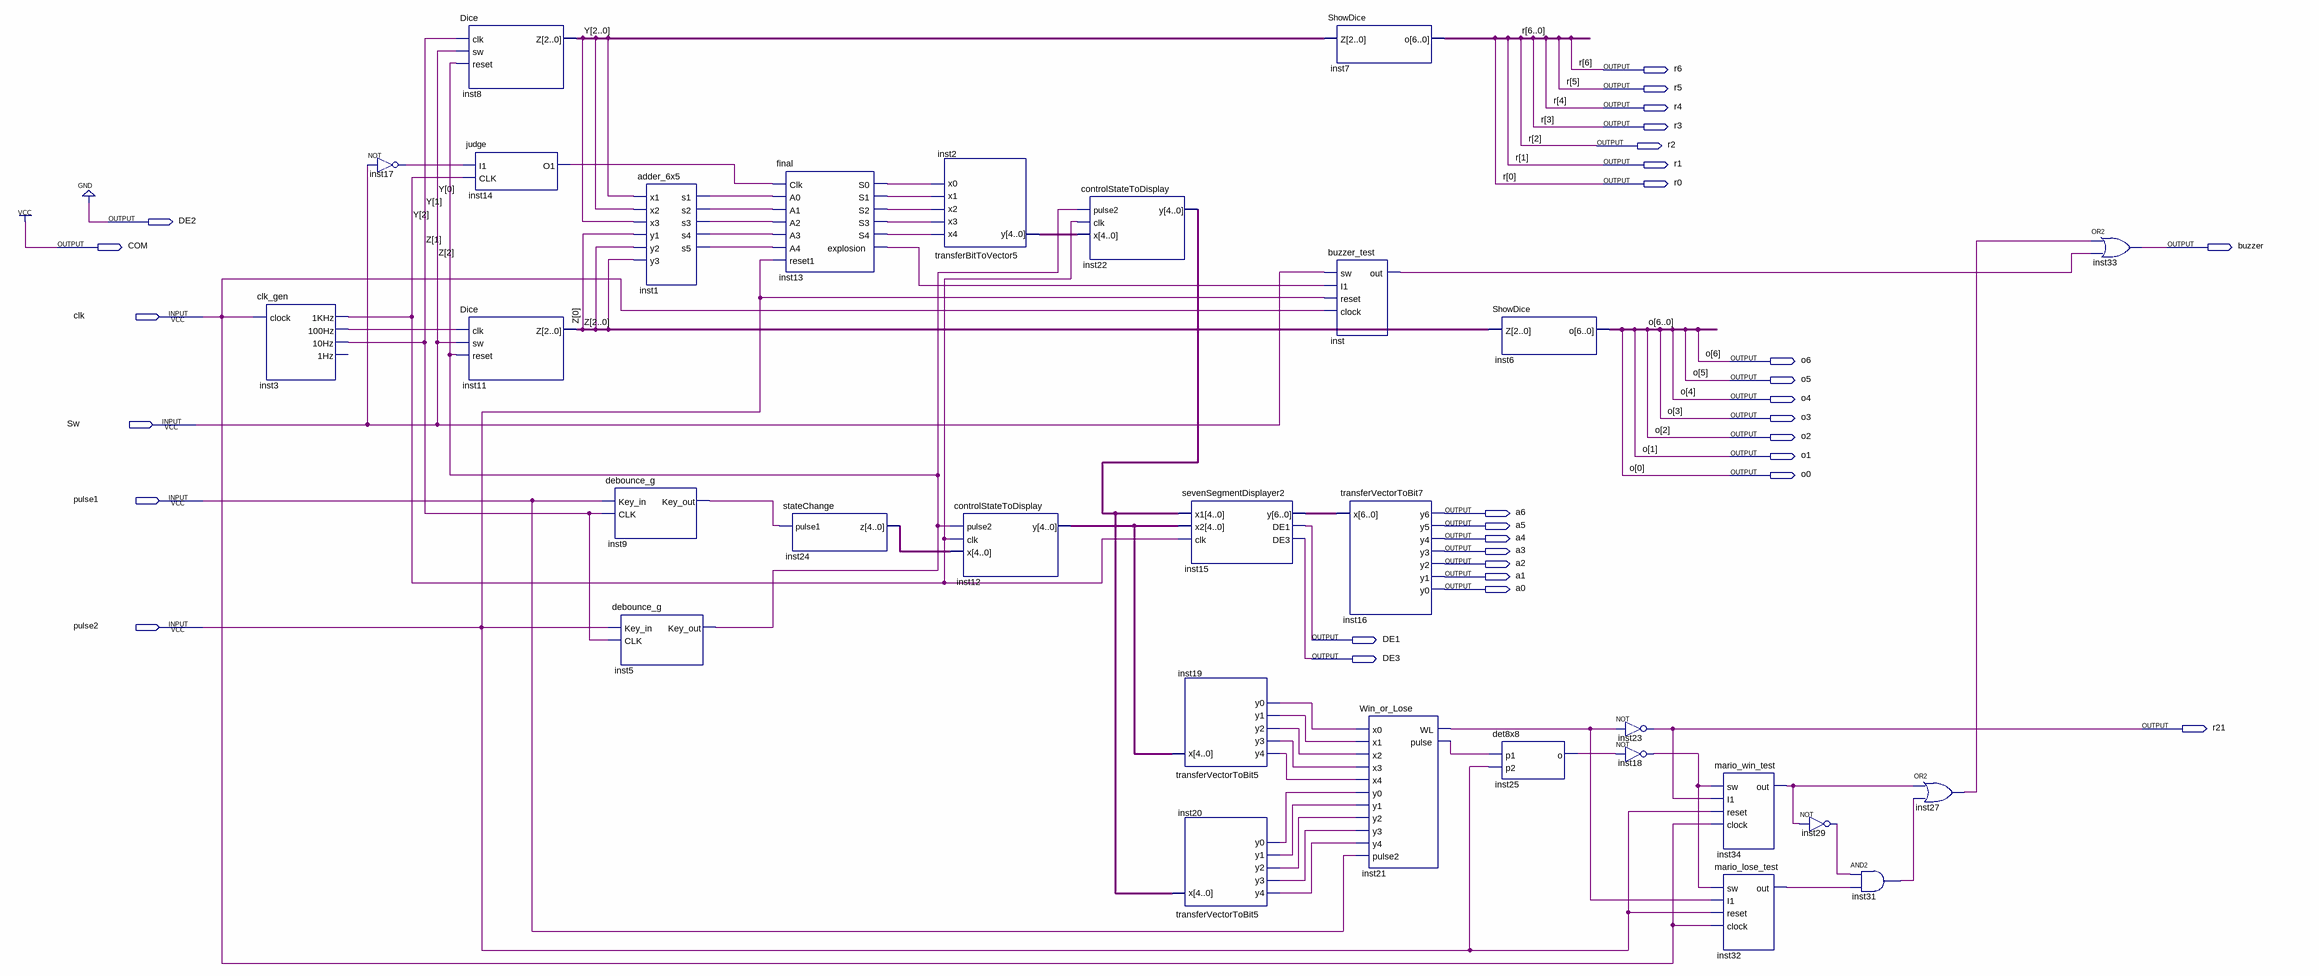
[diagram p0: schematic sheet]
// Quartus schematic DiceTest.bdf as structural Verilog: 30 symbols, 31 pins
module DiceTest (
  input  clk,
  input  Sw,
  input  pulse1,
  input  pulse2,
  output r6,
  output r5,
  output r4,
  output r3,
  output r2,
  output r1,
  output r0,
  output DE2,
  output COM,
  output buzzer,
  output o6,
  output o5,
  output o4,
  output o3,
  output o2,
  output o1,
  output o0,
  output a6,
  output a5,
  output a4,
  output a3,
  output a2,
  output a1,
  output a0,
  output DE1,
  output DE3,
  output r21
);

  wire inst1_s1, inst1_s2, inst1_s3, inst1_s4, inst1_s5, inst3_1khz, inst3_10hz, inst3_100hz, inst5_key_out,
       inst9_key_out, inst13_explosion, inst13_s0, inst13_s1, inst13_s2, inst13_s3, inst13_s4, inst14_o1,
       inst17_out, inst18_out, inst19_y0, inst19_y1, inst19_y2, inst19_y3, inst19_y4, inst20_y0, inst20_y1,
       inst20_y2, inst20_y3, inst20_y4, inst21_pulse, inst21_wl, inst25_o, inst27_out, inst29_out,
       inst31_out, inst32_out, inst34_out, inst_out;
  wire [2:0] Y, Z;
  wire [4:0] inst2_y, inst12_y, inst22_y, inst24_z;
  wire [6:0] inst15_y;

  clk_gen inst3 (.clock(clk), .\1KHz (inst3_1khz), .\100Hz (inst3_100hz), .\10Hz (inst3_10hz));  // open: 1Hz
  not inst17 (inst17_out, Sw);
  Dice inst8 (.clk(inst3_10hz), .sw(Sw), .reset(inst5_key_out), .Z(Y));
  judge inst14 (.I1(inst17_out), .CLK(inst3_1khz), .O1(inst14_o1));
  Dice inst11 (.clk(inst3_100hz), .sw(Sw), .reset(inst5_key_out), .Z(Z));
  debounce_g inst9 (.Key_in(pulse1), .CLK(inst3_10hz), .Key_out(inst9_key_out));
  adder_6x5 inst1 (
    .x1(Y[0]), .x2(Y[1]), .x3(Y[2]), .y1(Z[0]), .y2(Z[1]), .y3(Z[2]), .s1(inst1_s1), .s2(inst1_s2),
    .s3(inst1_s3), .s4(inst1_s4), .s5(inst1_s5));
  debounce_g inst5 (.Key_in(pulse2), .CLK(inst3_10hz), .Key_out(inst5_key_out));
  \final  inst13 (
    .Clk(inst14_o1), .A0(inst1_s1), .A1(inst1_s2), .A2(inst1_s3), .A3(inst1_s4), .A4(inst1_s5),
    .reset1(pulse2), .S0(inst13_s0), .S1(inst13_s1), .S2(inst13_s2), .S3(inst13_s3), .S4(inst13_s4),
    .explosion(inst13_explosion));
  stateChange inst24 (.pulse1(inst9_key_out), .z(inst24_z));
  transferBitToVector5 inst2 (
    .x4(inst13_s4), .x3(inst13_s3), .x2(inst13_s2), .x1(inst13_s1), .x0(inst13_s0), .y(inst2_y));
  controlStateToDisplay inst12 (.pulse2(inst5_key_out), .clk(inst3_1khz), .x(inst24_z), .y(inst12_y));
  controlStateToDisplay inst22 (.pulse2(inst5_key_out), .clk(inst3_1khz), .x(inst2_y), .y(inst22_y));
  sevenSegmentDisplayer2 inst15 (.x1(inst22_y), .x2(inst12_y), .clk(inst3_1khz), .y(inst15_y), .DE1(DE1), .DE3(DE3));
  transferVectorToBit5 inst19 (
    .x(inst12_y), .y4(inst19_y4), .y3(inst19_y3), .y2(inst19_y2), .y1(inst19_y1), .y0(inst19_y0));
  transferVectorToBit5 inst20 (
    .x(inst22_y), .y4(inst20_y4), .y3(inst20_y3), .y2(inst20_y2), .y1(inst20_y1), .y0(inst20_y0));
  ShowDice inst7 (.Z(Y), .o({r6, r5, r4, r3, r2, r1, r0}));
  buzzer_test inst (.sw(Sw), .I1(inst13_explosion), .reset(pulse2), .clock(clk), .out(inst_out));
  transferVectorToBit7 inst16 (.x(inst15_y), .y6(a6), .y5(a5), .y4(a4), .y3(a3), .y2(a2), .y1(a1), .y0(a0));
  Win_or_Lose inst21 (
    .x0(inst19_y0), .x1(inst19_y1), .x2(inst19_y2), .x3(inst19_y3), .x4(inst19_y4), .y0(inst20_y0),
    .y1(inst20_y1), .y2(inst20_y2), .y3(inst20_y3), .y4(inst20_y4), .pulse2(pulse1), .WL(inst21_wl),
    .pulse(inst21_pulse));
  ShowDice inst6 (.Z(Z), .o({o6, o5, o4, o3, o2, o1, o0}));
  det8x8 inst25 (.p1(inst21_pulse), .p2(pulse2), .o(inst25_o));
  not inst23 (r21, inst21_wl);
  not inst18 (inst18_out, inst25_o);
  mario_win_test inst34 (.sw(inst18_out), .I1(r21), .reset(pulse2), .clock(clk), .out(inst34_out));
  mario_lose_test inst32 (.sw(inst18_out), .I1(inst21_wl), .reset(pulse2), .clock(clk), .out(inst32_out));
  not inst29 (inst29_out, inst34_out);
  and inst31 (inst31_out, inst29_out, inst32_out);
  or inst27 (inst27_out, inst34_out, inst31_out);
  or inst33 (buzzer, inst27_out, inst_out);

  assign COM = 1'b1;
  assign DE2 = 1'b0;
endmodule
